# Altium schematic sheet rev02_10.SchDoc
size 409 x 282 mm
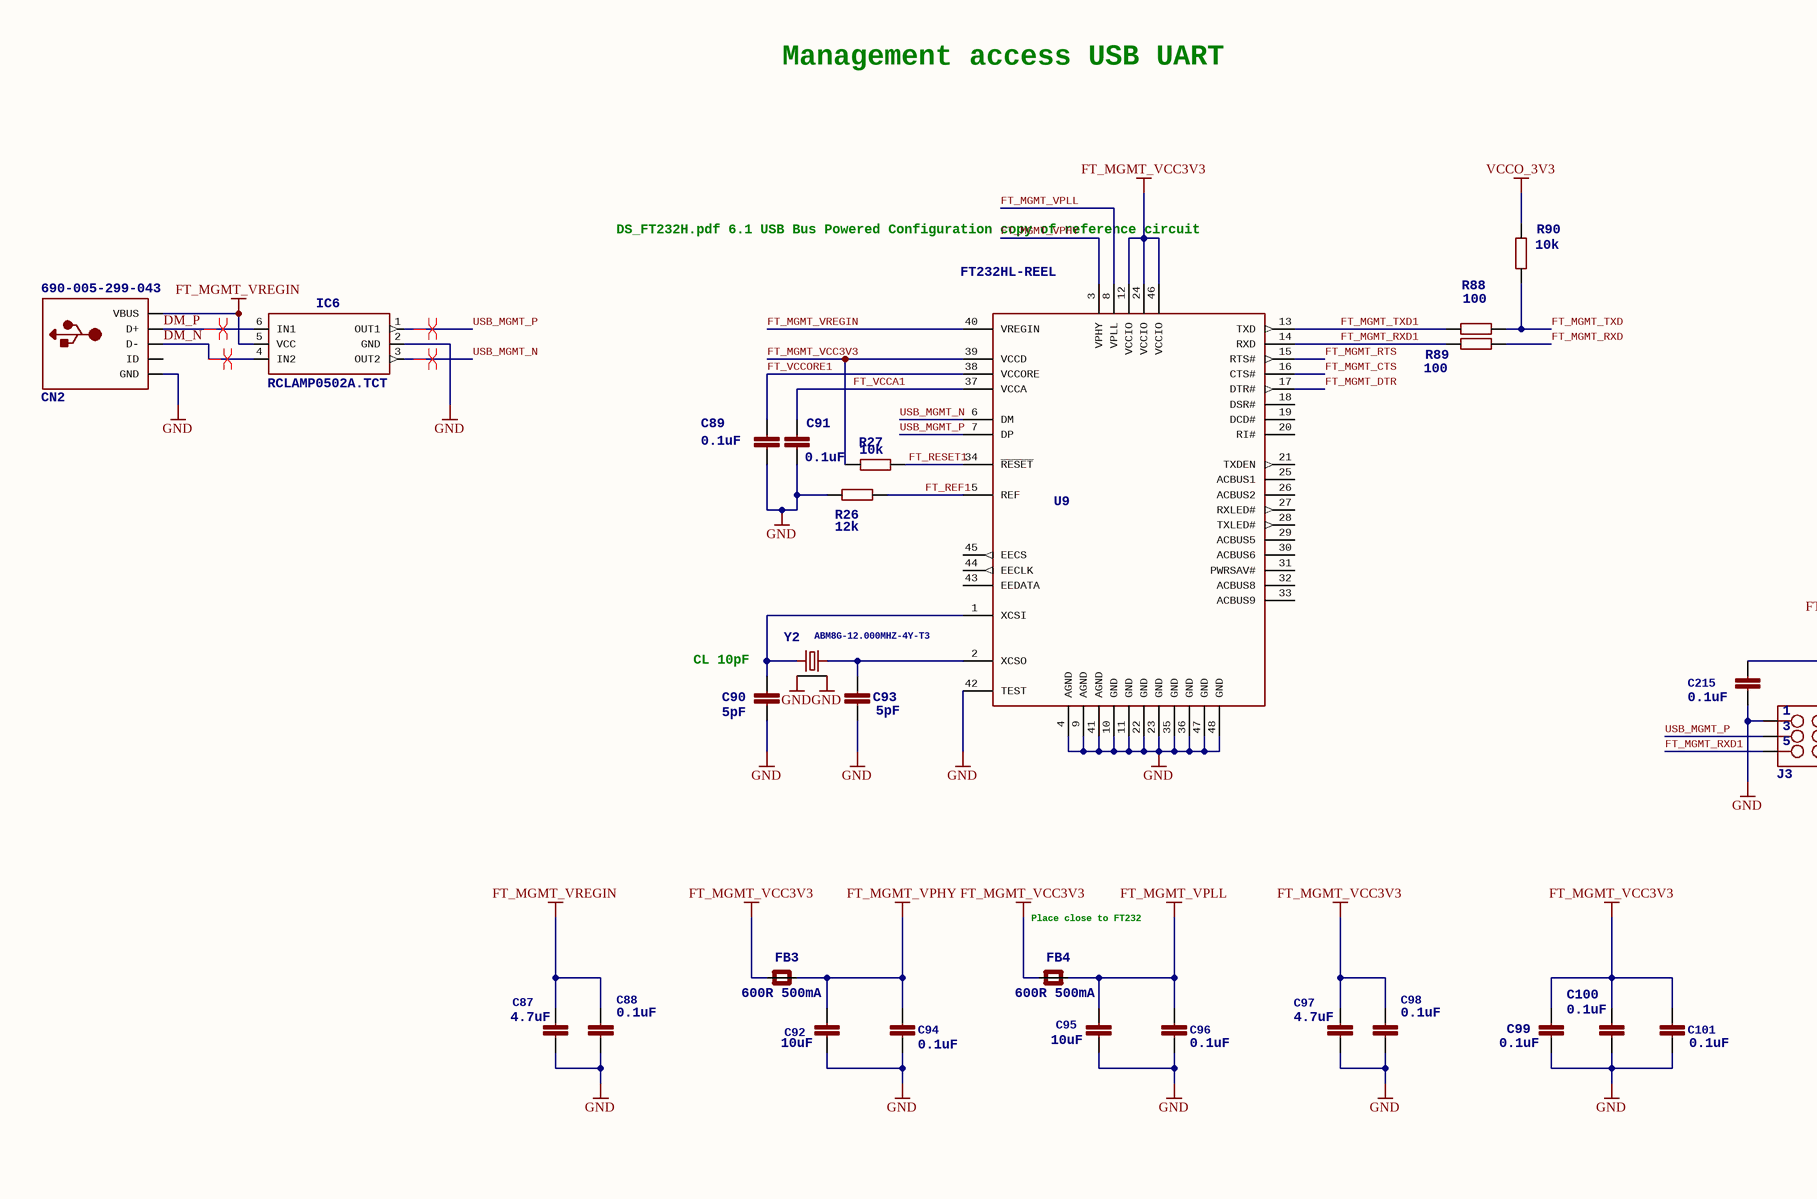
[diagram p0: rev02_10.SchDoc, left]
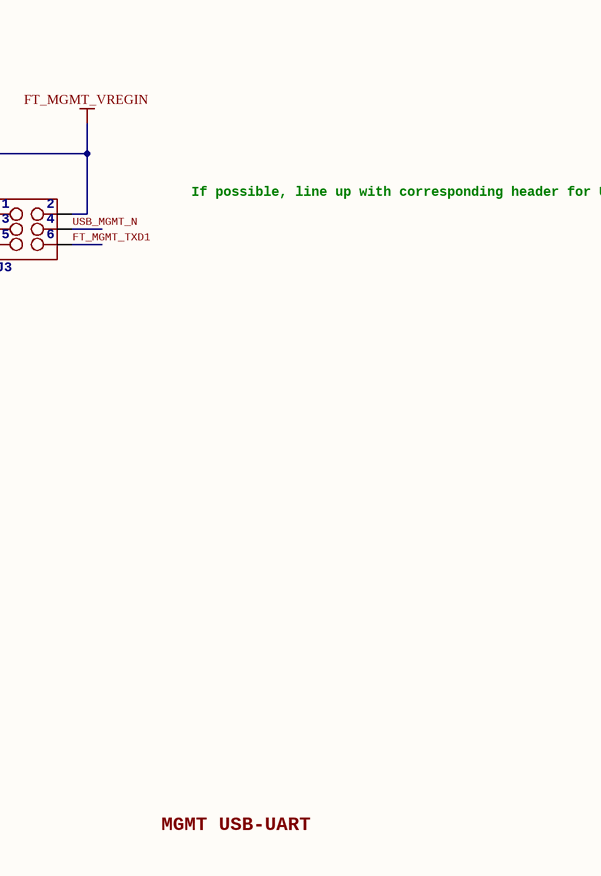
[diagram p1: rev02_10.SchDoc, right]

## Parts
C87  value 4.7uF  [C_0805]  (hidden comment: GRM21BR71A475KA73L)
C88  value 0.1uF  [C_0402]
C89  value 0.1uF  [C_0402]
C90  value 5pF  [C_0402]
C91  value 0.1uF  >NAME: C91  [C_0402]
C92  value 10uF  [C_0805]
C93  value 5pF  [C_0402]
C94  value 0.1uF  [C_0402]
C95  value 10uF  [C_0805]
C96  value 0.1uF  [C_0402]
C97  value 4.7uF  [C_0805]  (hidden comment: GRM21BR71A475KA73L)
C98  value 0.1uF  [C_0402]
C99  value 0.1uF  [C_0402]
C100  value 0.1uF  [C_0402]
C101  value 0.1uF  [C_0402]
C215  value 0.1uF  [C_0402]
CN2  690-005-299-043  [USB-MINIB]
FB3  >NAME: FB3  >VALUE: 600R 500mA  [L_0603]  (hidden comment: FBMH1608HL601-T)
FB4  >NAME: FB4  >VALUE: 600R 500mA  [L_0603]  (hidden comment: FBMH1608HL601-T)
IC6  RCLAMP0502A.TCT  >NAME: IC6  [RCLAMP0502A]
J3  M03X2NO_SILK  [PLD-6]  (value not drawn)
R26  value 12k  [R_0402]
R27  value 10k  >NAME: R27  [R_0402]
R88  value 100  [R_0402]
R89  value 100  [R_0402]
R90  value 10k  [R_0402]
U9  FT232HL-REEL  >NAME: U9  [LQFP-48]
Y2  ABM8G-12.000MHZ-4Y-T3  [CRYSTAL_3.2X2.5]

## Nets
FT_MGMT_VCC3V3: C97.1 C98.1 C99.1 C100.1 C101.1 FB3.1(P$1) FB4.1(P$1) R27.2 U9.12(VCCIO) U9.24(VCCIO) U9.39(VCCD) U9.46(VCCIO)
FT_MGMT_VPHY: C92.1 C94.1 FB3.2(P$2) U9.3(VPHY)
FT_MGMT_VPLL: C95.1 C96.1 FB4.2(P$2) U9.8(VPLL)
FT_MGMT_VREGIN: C87.1 C88.1 C215.1 CN2.VBUS IC6.5(VCC) J3.2 U9.40(VREGIN)
GND: C87.2 C88.2 C89.2 C90.1 C91.2 C92.2 C93.1 C94.2 C95.2 C96.2 C97.2 C98.2 C99.2 C100.2 C101.2 C215.2 CN2.GND IC6.2(GND) J3.1 R26.2 U9.4(AGND) U9.9(AGND) U9.10(GND) U9.11(GND) U9.22(GND) U9.23(GND) U9.35(GND) U9.36(GND) U9.41(AGND) U9.42(TEST) U9.47(GND) U9.48(GND) Y2.2 Y2.4
VCCO_3V3: R90.1
DM_N: CN2.D- IC6.4(IN2)
DM_P: CN2.D+ IC6.6(IN1)
FT_MGMT_CTS: U9.16(CTS#)
FT_MGMT_DTR: U9.17(DTR#)
FT_MGMT_RTS: U9.15(RTS#)
FT_MGMT_RXD: R89.1
FT_MGMT_RXD1: J3.5 R89.2 U9.14(RXD)
FT_MGMT_TXD: R88.1 R90.2
FT_MGMT_TXD1: J3.6 R88.2 U9.13(TXD)
FT_REF1: R26.1 U9.5(REF)
FT_RESET1: R27.1 U9.34(~{RESET})
FT_VCCA1: C91.1 U9.37(VCCA)
FT_VCCORE1: C89.1 U9.38(VCCORE)
USB_MGMT_N: IC6.3(OUT2) J3.4 U9.6(DM)
USB_MGMT_P: IC6.1(OUT1) J3.3 U9.7(DP)
NetC90_2: C90.2 U9.1(XCSI) Y2.3
NetC93_2: C93.2 U9.2(XCSO) Y2.1

Not connected (* = marked no-connect by the designer): CN2 ID; U9 18(DSR#) 19(DCD#) 20(RI#) 21(TXDEN) 25(ACBUS1) 26(ACBUS2) 27(RXLED#) 28(TXLED#) 29(ACBUS5) 30(ACBUS6) 31(PWRSAV#) 32(ACBUS8) 33(ACBUS9) 43(EEDATA) 44(EECLK) 45(EECS)

## Layout directives
differential pair: DM_N, DM_P, USB_MGMT_N, USB_MGMT_P

## Notes on the sheet
- Management access USB UART
- DS_FT232H.pdf
  6.1 USB Bus Powered Configuration
  copy of reference circuit
- CL 10pF
- If possible, line up with
  corresponding header
  for USB-UART and label
  pins on silk screen
- (near FB4) Place close to FT232
- MGMT USB-UART

## Library data of the parts
C87 C97 = C-EUC0603: 0805 CAPACITOR
C88-C90 C93 C94 C96 C98-C101 C215 = C-EUC0402: 0402 CAPACITOR
C91 = C-EUC0402: 0402 CAPACITOR; DIELECTRIC: X7R; RATED_VOLTAGE: 10V; >VALUE: 0.1 uF
C92 C95 = C-EUC0805: 0805 CAPACITOR
CN2 = USBMINIB: mini USB type B Connector
FB3 FB4 = FERRITE_0603MP: Ferrite Bead 600 Ohm 500mA
IC6 = RCLAMP0502ASC-89: USB protective diodes; MFR: SEMTECH; MPN: RCLAMP0502A; OC_FARNELL: 2058982; >VALUE: RCLAMP0502ASC-89
J3 = M03X2NO_SILK: 2x3 .1" header; 1: 1; 2: 2; 3: 3; 4: 4; 5: 5; 6: 6
R26 = R-EU_R0402: 0402 Resistor 1%
R27 R88-R90 = R-EU_R0402: 0402 Resistor 5%
  R27: TOLERANCE: 5%
U9 = FT232H_SERIAL: INTERFACE, USB - UART/FIFO; OC_FARNELL: 1870924; >VALUE: FT232H_SERIAL
Y2 = CRYSTALTHIN: Crystal 12MHz